# Altium schematic sheet RelayOutput.SchDoc: Relay output
size A3; Author: eldar6776@hotmail.com; DrawnBy: Eldar Dedić; Organization: PROVEN d.o.o.; Address1: Adema Buće 102; Address2: 71000 Sarajevo; Address3: Federacija BiH; Address4: Bosna i Hercegovina; DocumentNumber: DE211213; Revision: 001; SheetNumber: 5; SheetTotal: 15; ProjectName: MIKSER SIROVINE
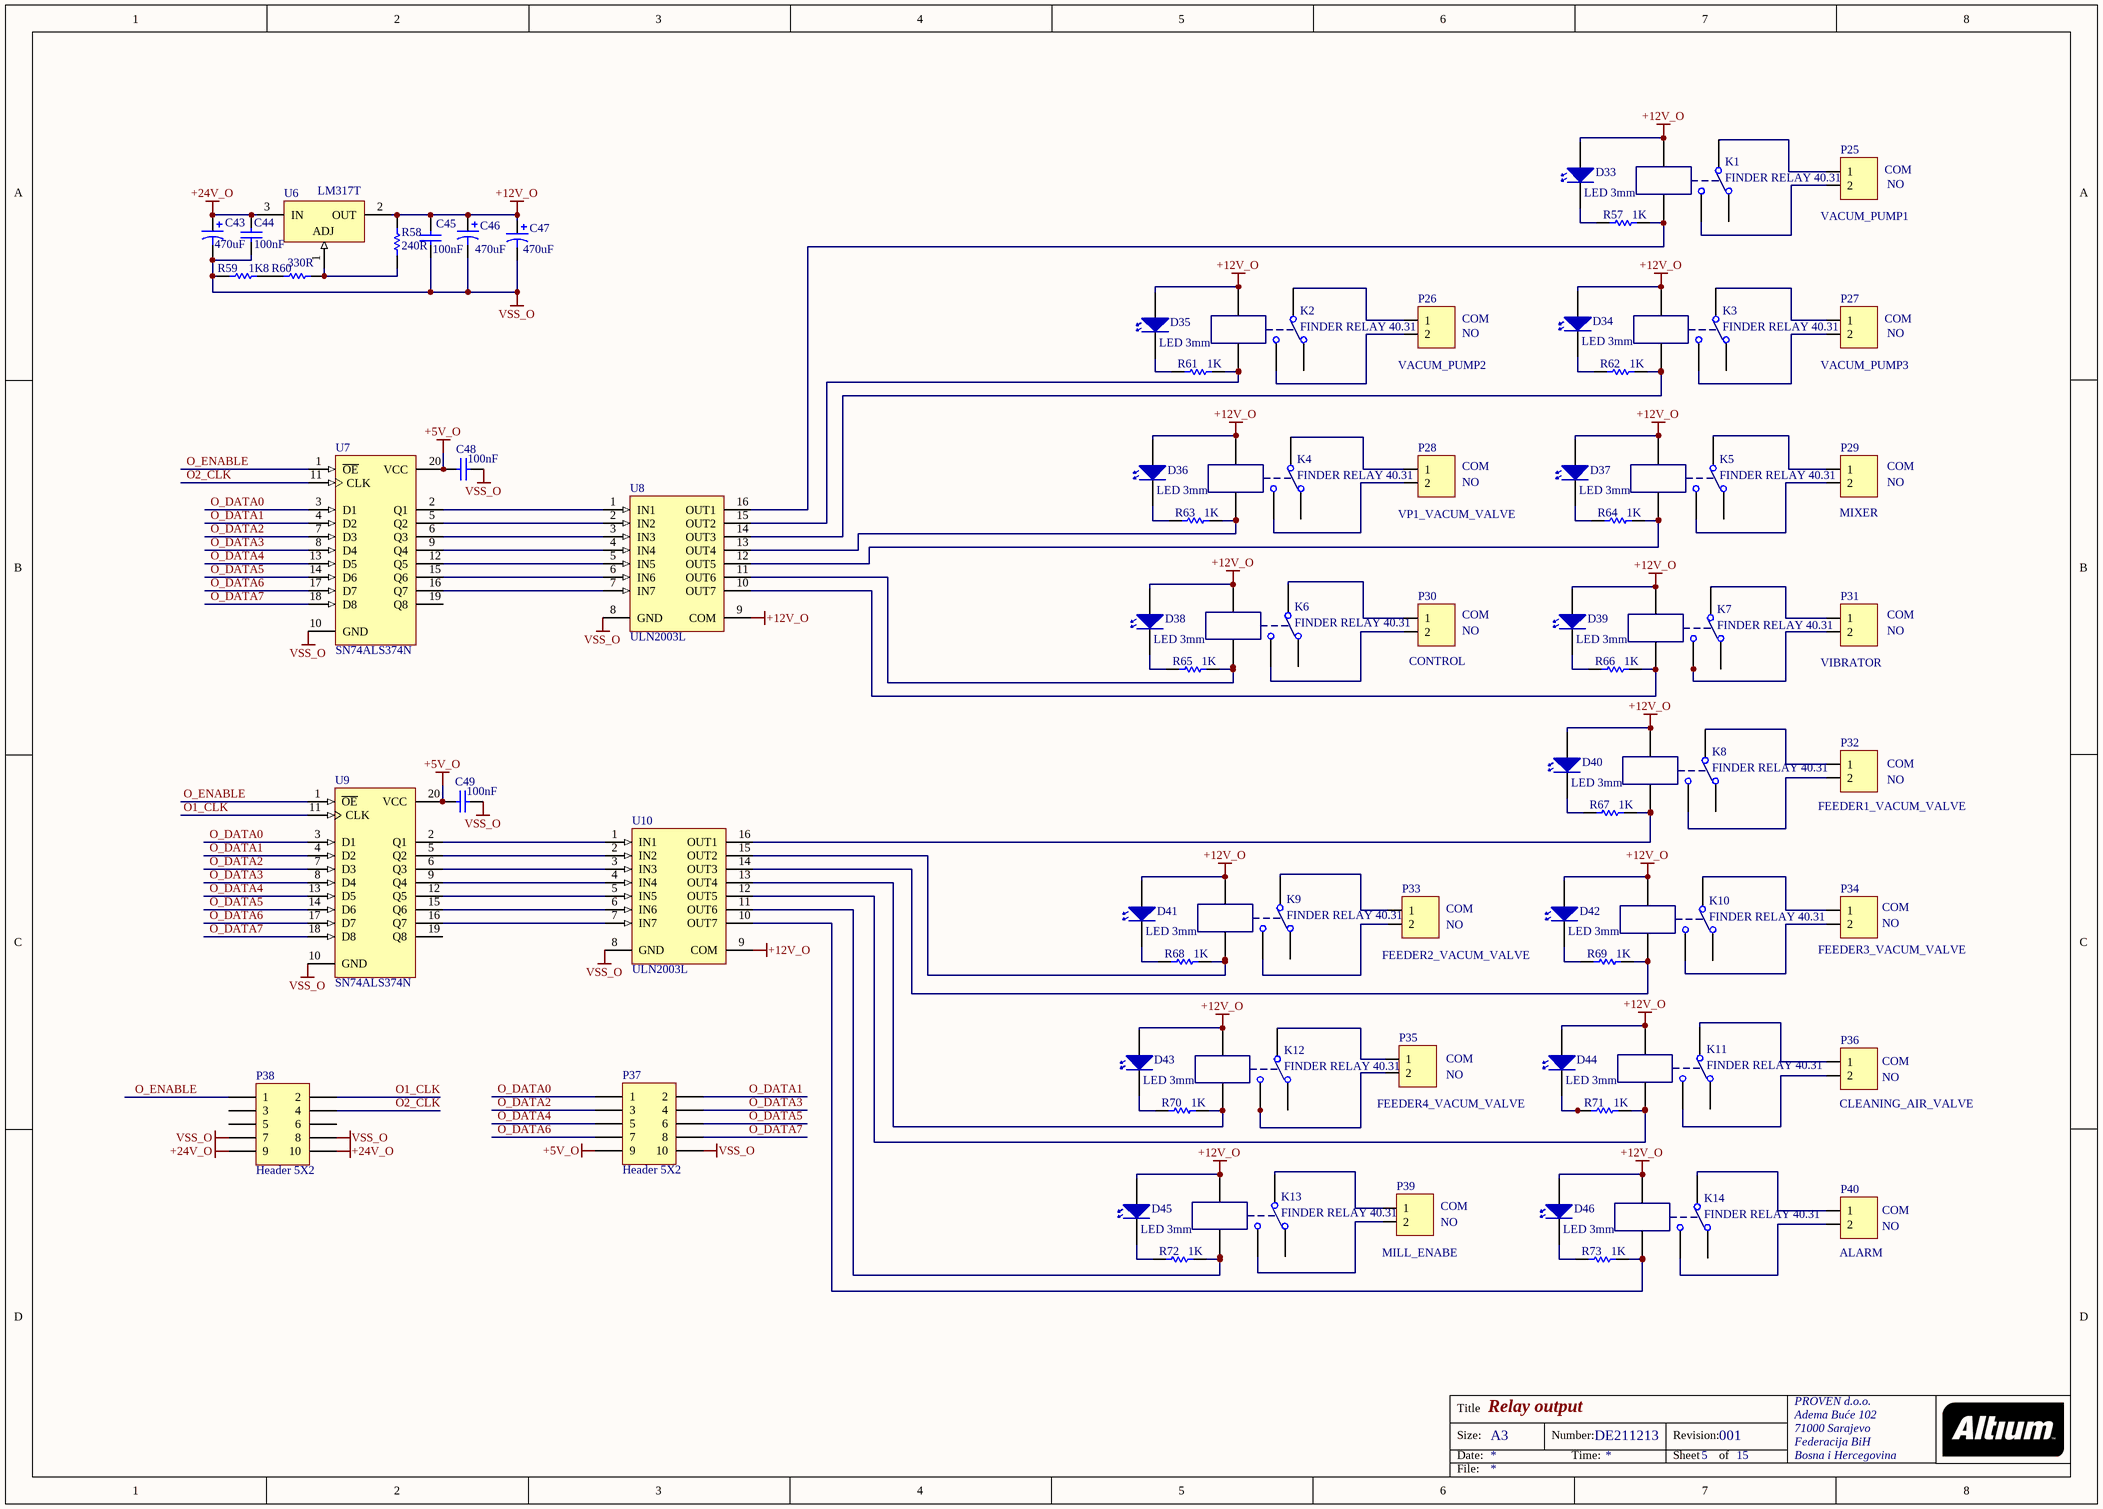
[diagram p0: RelayOutput.SchDoc]

## Parts
C43  470uF  [CAPPR5-10X16]
C44  value 100nF  [1206]
C45  value 100nF  [1206]
C46  470uF  [CAPPR5-10X16]
C47  470uF  [CAPPR5-10X16]
C48  value 100nF  [1206]
C49  value 100nF  [1206]
D33  LED 3mm  [LED 3mm]
D34  LED 3mm  [LED 3mm]
D35  LED 3mm  [LED 3mm]
D36  LED 3mm  [LED 3mm]
D37  LED 3mm  [LED 3mm]
D38  LED 3mm  [LED 3mm]
D39  LED 3mm  [LED 3mm]
D40  LED 3mm  [LED 3mm]
D41  LED 3mm  [LED 3mm]
D42  LED 3mm  [LED 3mm]
D43  LED 3mm  [LED 3mm]
D44  LED 3mm  [LED 3mm]
D45  LED 3mm  [LED 3mm]
D46  LED 3mm  [LED 3mm]
K1  FINDER RELAY 40.31  [FINDER 40.31]
K2  FINDER RELAY 40.31  [FINDER 40.31]
K3  FINDER RELAY 40.31  [FINDER 40.31]
K4  FINDER RELAY 40.31  [FINDER 40.31]
K5  FINDER RELAY 40.31  [FINDER 40.31]
K6  FINDER RELAY 40.31  [FINDER 40.31]
K7  FINDER RELAY 40.31  [FINDER 40.31]
K8  FINDER RELAY 40.31  [FINDER 40.31]
K9  FINDER RELAY 40.31  [FINDER 40.31]
K10  FINDER RELAY 40.31  [FINDER 40.31]
K11  FINDER RELAY 40.31  [FINDER 40.31]
K12  FINDER RELAY 40.31  [FINDER 40.31]
K13  FINDER RELAY 40.31  [FINDER 40.31]
K14  FINDER RELAY 40.31  [FINDER 40.31]
P25  VACUM_PUMP1  [TERMINAL BLOK 2]
P26  VACUM_PUMP2  [TERMINAL BLOK 2]
P27  VACUM_PUMP3  [TERMINAL BLOK 2]
P28  VP1_VACUM_VALVE  [TERMINAL BLOK 2]
P29  MIXER  [TERMINAL BLOK 2]
P30  CONTROL  [TERMINAL BLOK 2]
P31  VIBRATOR  [TERMINAL BLOK 2]
P32  FEEDER1_VACUM_VALVE  [TERMINAL BLOK 2]
P33  FEEDER2_VACUM_VALVE  [TERMINAL BLOK 2]
P34  FEEDER3_VACUM_VALVE  [TERMINAL BLOK 2]
P35  FEEDER4_VACUM_VALVE  [TERMINAL BLOK 2]
P36  CLEANING_AIR_VALVE  [TERMINAL BLOK 2]
P37  Header 5X2  [HDR2X5]
P38  Header 5X2  [HDR2X5]
P39  MILL_ENABE  [TERMINAL BLOK 2]
P40  ALARM  [TERMINAL BLOK 2]
R57  1K  [ERA-0805]
R58  240R  [ERA-0805]
R59  1K8  [ERA-0805]
R60  330R  [ERA-0805]
R61  1K  [ERA-0805]
R62  1K  [ERA-0805]
R63  1K  [ERA-0805]
R64  1K  [ERA-0805]
R65  1K  [ERA-0805]
R66  1K  [ERA-0805]
R67  1K  [ERA-0805]
R68  1K  [ERA-0805]
R69  1K  [ERA-0805]
R70  1K  [ERA-0805]
R71  1K  [ERA-0805]
R72  1K  [ERA-0805]
R73  1K  [ERA-0805]
U6  LM317T  [221A-04]
U7  SN74ALS374N  [N020D]
U8  ULN2003L  [L16_N]
U9  SN74ALS374N  [N020D]
U10  ULN2003L  [L16_N]

## Nets
+5V_O: C48.1 C49.1 P37.9 U7.20(VCC) U9.20(VCC)
+12V_O: C45.2 C46.1 C47.1 D33.2 D34.2 D35.2 D36.2 D37.2 D38.2 D39.2 D40.2 D41.2 D42.2 D43.2 D44.2 D45.2 D46.2 K1.1 K2.1 K3.1 K4.1 K5.1 K6.1 K7.1 K8.1 K9.1 K10.1 K11.1 K12.1 K13.1 K14.1 R58.2 U6.2(OUT) U8.9(COM) U10.9(COM)
+24V_O: C43.1 C44.2 P38.9 P38.10 U6.3(IN)
VSS_O: C43.2 C44.1 C45.1 C46.2 C47.2 C48.2 C49.2 P37.10 P38.7 P38.8 R59.2 U7.10(GND) U8.8(GND) U9.10(GND) U10.8(GND)
O1_CLK: P38.2 U9.11(CLK)
O2_CLK: P38.4 U7.11(CLK)
O_DATA0: P37.1 U7.3(D1) U9.3(D1)
O_DATA1: P37.2 U7.4(D2) U9.4(D2)
O_DATA2: P37.3 U7.7(D3) U9.7(D3)
O_DATA3: P37.4 U7.8(D4) U9.8(D4)
O_DATA4: P37.5 U7.13(D5) U9.13(D5)
O_DATA5: P37.6 U7.14(D6) U9.14(D6)
O_DATA6: P37.7 U7.17(D7) U9.17(D7)
O_DATA7: P37.8 U7.18(D8) U9.18(D8)
O_ENABLE: P38.1 U7.1(~{OE}) U9.1(~{OE})
NetD33_1: D33.1 R57.1
NetD34_1: D34.1 R62.1
NetD35_1: D35.1 R61.1
NetD36_1: D36.1 R63.1
NetD37_1: D37.1 R64.1
NetD38_1: D38.1 R65.1
NetD39_1: D39.1 R66.1
NetD40_1: D40.1 R67.1
NetD41_1: D41.1 R68.1
NetD42_1: D42.1 R69.1
NetD43_1: D43.1 R70.1
NetD44_1: D44.1 R71.1
NetD45_1: D45.1 R72.1
NetD46_1: D46.1 R73.1
NetK1_2: K1.2 R57.2 U8.16(OUT1)
NetK1_3: K1.3 P25.1
NetK1_4: K1.4 P25.2
NetK2_2: K2.2 R61.2 U8.15(OUT2)
NetK2_3: K2.3 P26.1
NetK2_4: K2.4 P26.2
NetK3_2: K3.2 R62.2 U8.14(OUT3)
NetK3_3: K3.3 P27.1
NetK3_4: K3.4 P27.2
NetK4_2: K4.2 R63.2 U8.13(OUT4)
NetK4_3: K4.3 P28.1
NetK4_4: K4.4 P28.2
NetK5_2: K5.2 R64.2 U8.12(OUT5)
NetK5_3: K5.3 P29.1
NetK5_4: K5.4 P29.2
NetK6_2: K6.2 R65.2 U8.11(OUT6)
NetK6_3: K6.3 P30.1
NetK6_4: K6.4 P30.2
NetK7_2: K7.2 R66.2 U8.10(OUT7)
NetK7_3: K7.3 P31.1
NetK7_4: K7.4 P31.2
NetK8_2: K8.2 R67.2 U10.16(OUT1)
NetK8_3: K8.3 P32.1
NetK8_4: K8.4 P32.2
NetK9_2: K9.2 R68.2 U10.15(OUT2)
NetK9_3: K9.3 P33.1
NetK9_4: K9.4 P33.2
NetK10_2: K10.2 R69.2 U10.14(OUT3)
NetK10_3: K10.3 P34.1
NetK10_4: K10.4 P34.2
NetK11_2: K11.2 R71.2 U10.12(OUT5)
NetK11_3: K11.3 P36.1
NetK11_4: K11.4 P36.2
NetK12_2: K12.2 R70.2 U10.13(OUT4)
NetK12_3: K12.3 P35.1
NetK12_4: K12.4 P35.2
NetK13_2: K13.2 R72.2 U10.11(OUT6)
NetK13_3: K13.3 P39.1
NetK13_4: K13.4 P39.2
NetK14_2: K14.2 R73.2 U10.10(OUT7)
NetK14_3: K14.3 P40.1
NetK14_4: K14.4 P40.2
NetR58_1: R58.1 R60.1 U6.1(ADJ)
NetR59_1: R59.1 R60.2
NetU7_2: U7.2(Q1) U8.1(IN1)
NetU7_5: U7.5(Q2) U8.2(IN2)
NetU7_6: U7.6(Q3) U8.3(IN3)
NetU7_9: U7.9(Q4) U8.4(IN4)
NetU7_12: U7.12(Q5) U8.5(IN5)
NetU7_15: U7.15(Q6) U8.6(IN6)
NetU7_16: U7.16(Q7) U8.7(IN7)
NetU9_2: U9.2(Q1) U10.1(IN1)
NetU9_5: U9.5(Q2) U10.2(IN2)
NetU9_6: U9.6(Q3) U10.3(IN3)
NetU9_9: U9.9(Q4) U10.4(IN4)
NetU9_12: U9.12(Q5) U10.5(IN5)
NetU9_15: U9.15(Q6) U10.6(IN6)
NetU9_16: U9.16(Q7) U10.7(IN7)

Not connected (* = marked no-connect by the designer): K1 5; K2 5; K3 5; K4 5; K5 5; K6 5; K7 5; K8 5; K9 5; K10 5; K11 5; K12 5; K13 5; K14 5; P38 3 5 6; U7 19(Q8); U9 19(Q8)

## Notes on the sheet
- (near P25) COM
- (near P25) NO
- (near P26) NO
- (near P26) COM
- (near P27) COM
- (near P27) NO
- (near P28) COM
- (near P28) NO
- (near P29) COM
- (near P29) NO
- (near P30) COM
- (near P30) NO
- (near P31) COM
- (near P31) NO
- (near P32) COM
- (near P32) NO
- (near P33) COM
- (near P34) COM
- (near P33) NO
- (near P34) NO
- (near P35) COM
- (near P35) NO
- (near P36) COM
- (near P36) NO
- (near P39) COM
- (near P39) NO
- (near P40) COM
- (near P40) NO
- Title
- Size:
- Date:
- A3
- Number:
- Time:
- Revision:
- Sheet
- of
- File:

## Library data of the parts
C43 C46 C47 = EKA00DD347F00: Aluminum Electrolytic Capacitor, Radial Style with Long Leads: 470uF, 35V; Note: Refer to Manufacturer's Data Sheets for other lead formations; DrillSize: Nominal, Rounded To The Nearest 0.1mm; Published: 19-Mar-2004; DatasheetDocument: 20-Feb-2001; PackageReference: CAPPR5-10X16; Publisher: Altium Limited; ComponentLink1Description: Manufacturer Link; ComponentLink1URL: http://www.vishay.com/; ComponentLink2Description: Datasheet; ComponentLink2URL: http://www.vishay.com/docs/25014/eka.pdf; Value: 470uF
C44 C45 C48 C49 = C1206: Ceramic Chip Capacitor - Standard; Published: 17-Jul-2002; LatestRevisionDate: 19-Mar-2004; LatestRevisionNote: Silkscreen size reduced.; DatasheetDocument: Mar-2001; PackageDocument: Mar-2001; PackageReference: 1206; Publisher: Altium Limited; Code_JEITA: 1206; Code_IPC: 3216 [1206]; ComponentLink1Description: Manufacturer Link; ComponentLink1URL: http://www.kemet.com/; ComponentLink2Description: Datasheet; ComponentLink2URL: http://www.kemet.com/kemet/web/homepage/kechome.nsf/vapubfilesname/F3102TA.pdf/$file/F3102TA.pdf
P25-P36 P39 P40 = Terminal blok 2 pina: Terminal blok 2
P37 P38 = Header 5X2: Header, 5-Pin, Dual row; LatestRevisionDate: 17-Jul-2002; LatestRevisionNote: Re-released for DXP Platform.; Publisher: Altium Limited
R57-R73 = ERAS: Metal Film Thermosensitive Chip Resistor, 0.56 Ohm to 10k Ohm Range, 5% Tolerance, 0805 Size, 0.1 W; Note: If flow soldering, adjust pad width of PCB Footprint to 0.7 - 0.8 times the width of the resistor.; Published: 17-Dec-2003; LatestRevisionDate: 19-Mar-2004; LatestRevisionNote: Silkscreen size reduced.; PackageDocument: Mar-2003; PackageReference: ERA-0805; Publisher: Altium Limited; Code_IPC: 2012 [0805]; ComponentLink1Description: Manufacturer Link; ComponentLink1URL: http://www.panasonic.com/industrial/components/resistive_products.htm; ComponentLink2Description: Datasheet; ComponentLink2URL: http://www.panasonic.com/industrial/components/pdf/AOF0000CE1.pdf
U6 = LM317T: 3-Terminal Adjustable Positive Voltage Regulator; Note: Heatsink surface connected to pin 2.; Published: 17-Jul-2002; DatasheetVersion: 1988; PackageReference: 221A-04; Publisher: Altium Limited; PackageDescription: TO, Thru-Hole, Vertical, Heatsink Mounted; 3 In-Line Leads; Pitch 2.54 mm; Code_JEDEC: TO-262-AA; ComponentLink1Description: Manufacturer Link; ComponentLink1URL: http://www.onsemi.com/site/products/taxonomy/0,4438,503,00.html; ComponentLink2Description: Datasheet; ComponentLink2URL: http://www.onsemi.com/pub/Collateral/LM317-D.PDF
U7 U9 = SN74ALS374N: Octal D-Type Edge-Triggered Flip-Flop with 3-State Outputs; Published: 8-Jun-2000; LatestRevisionDate: 04-Mar-2005; LatestRevisionNote: Stylized 3D Model Added.; DatasheetVersion: May-1986; PackageVersion: Oct-1995; PackageReference: N020D; Publisher: Altium Limited; PackageDescription: DIP; 20 Leads; Row Spacing 7.62 mm; Pitch 2.54 mm; ComponentLink1Description: Manufacturer Link; ComponentLink1URL: http://www.ti.com/
U8 U10 = ULN2003L: High-Voltage, High-Current Darlington Array; Published: 13-Oct-2000; LatestRevisionDate: 13-Apr-2006; LatestRevisionNote: IPC-7351 Footprint Added.; DatasheetVersion: 1998; PackageReference: L16; Publisher: Altium Limited; PackageDescription: 16-Pin Small Outline Integrated Circuit 1.27 mm Pitch; Code_JEDEC: MS-012-AC; Code_IPC: SOIC127P600-16; ComponentLink1Description: Manufacturer Link; ComponentLink1URL: http://www.allegromicro.com/